# EAGLE design zumo_cam_01 (EAGLE 7.7.0)
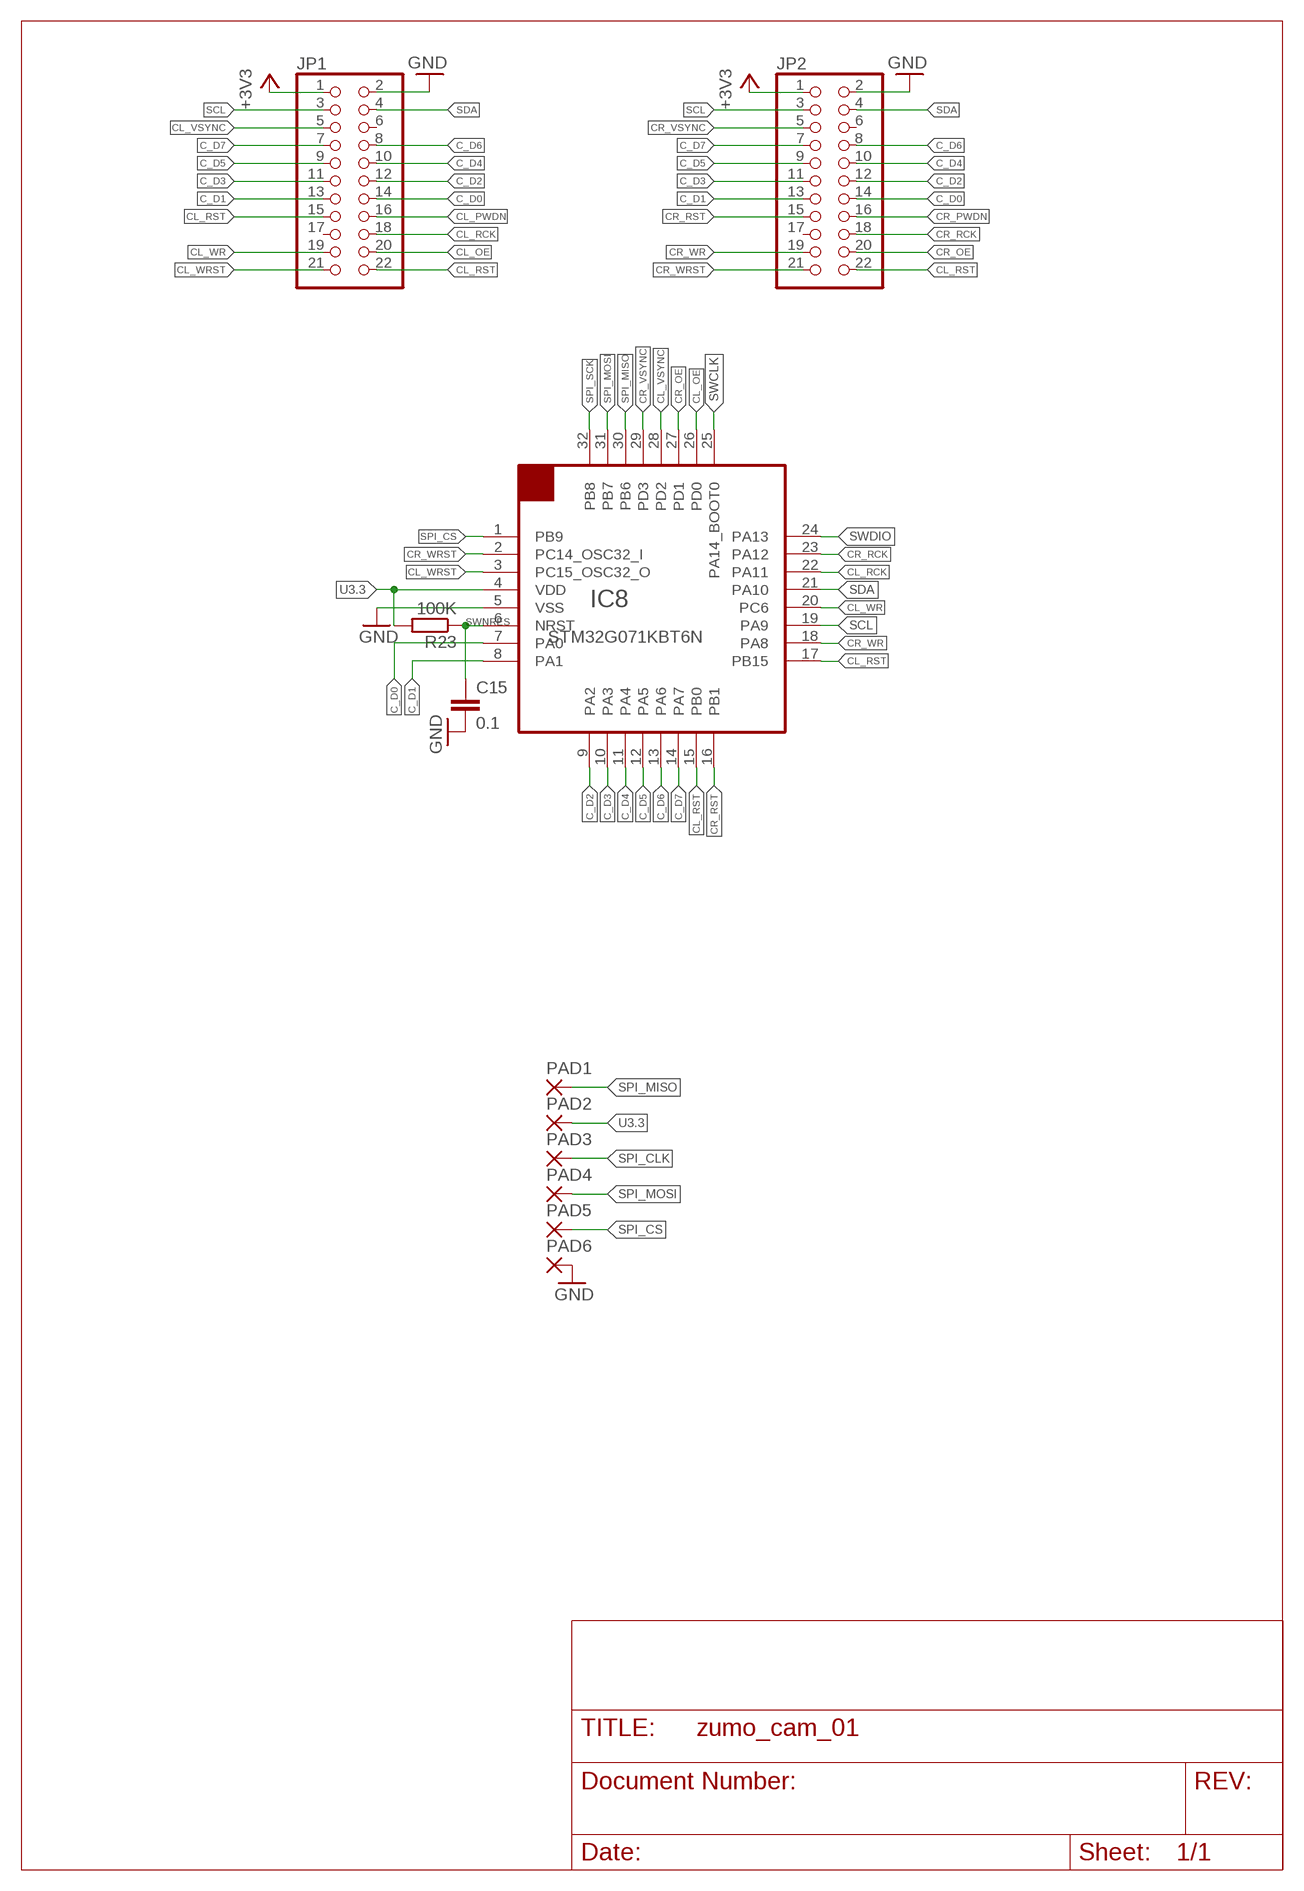
[diagram p0: schematic, sheet 1]

## Parts
C15  0.1  C-EUC0805  [C0805]
IC8  STM32G071KBT6N  [LQFP-32]
JP1  PINHD-2X11_2.54-SMD  [2X11SMD]
JP2  PINHD-2X11_2.54-SMD  [2X11SMD]
PAD1  SMD2  [SMD1,27-2,54]
PAD2  SMD2  [SMD1,27-2,54]
PAD3  SMD2  [SMD1,27-2,54]
PAD4  SMD2  [SMD1,27-2,54]
PAD5  SMD2  [SMD1,27-2,54]
PAD6  SMD2  [SMD1,27-2,54]
R23  100K  R-EU_R0805  [R0805]

## Nets
+3V3: JP1.1 JP2.1
C_D0: IC8.7(PA0) JP1.14 JP2.14
C_D1: IC8.8(PA1) JP1.13 JP2.13
C_D2: IC8.9(PA2) JP1.12 JP2.12
C_D3: IC8.10(PA3) JP1.11 JP2.11
C_D4: IC8.11(PA4) JP1.10 JP2.10
C_D5: IC8.12(PA5) JP1.9 JP2.9
C_D6: IC8.13(PA6) JP1.8 JP2.8
C_D7: IC8.14(PA7) JP1.7 JP2.7
CL_OE: IC8.26(PD0) JP1.20
CL_PWDN: JP1.16
CL_RCK: IC8.22(PA11) JP1.18
CL_RST: IC8.15(PB0) IC8.17(PB15) JP1.15 JP1.22 JP2.22
CL_VSYNC: IC8.28(PD2) JP1.5
CL_WR: IC8.20(PC6) JP1.19
CL_WRST: IC8.3(PC15_OSC32_O) JP1.21
CR_OE: IC8.27(PD1) JP2.20
CR_PWDN: JP2.16
CR_RCK: IC8.23(PA12) JP2.18
CR_RST: IC8.16(PB1) JP2.15
CR_VSYNC: IC8.29(PD3) JP2.5
CR_WR: IC8.18(PA8) JP2.19
CR_WRST: IC8.2(PC14_OSC32_I) JP2.21
GND [gnd]: C15.2 IC8.5(VSS) JP1.2 JP2.2 PAD6.1(P)
SCL: IC8.19(PA9) JP1.3 JP2.3
SDA: IC8.21(PA10) JP1.4 JP2.4
SPI_CLK: PAD3.1(P)
SPI_CS: IC8.1(PB9) PAD5.1(P)
SPI_MISO: IC8.30(PB6) PAD1.1(P)
SPI_MOSI: IC8.31(PB7) PAD4.1(P)
SPI_SCK: IC8.32(PB8)
SWCLK: IC8.25(PA14_BOOT0)
SWDIO: IC8.24(PA13)
SWNRES: C15.1 IC8.6(NRST) R23.1
U3.3 [power]: IC8.4(VDD) PAD2.1(P) R23.2
Unconnected: JP1.6 JP1.17 JP2.6 JP2.17

## Library data of the parts
C15 = rcl:C-EU: CAPACITOR, European symbol
IC8 = stm32:STM32G071KBT6N
JP1 JP2 = pinhead-1:PINHD-2X11: PIN HEADER
PAD1-PAD6 = wirepad:SMD2: SMD PAD
R23 = rcl:R-EU_: RESISTOR, European symbol

## Net classes
1 gnd: width 0.381 mm, drill 0.381 mm
2 power: width 0.381 mm, drill 0.381 mm

## Board
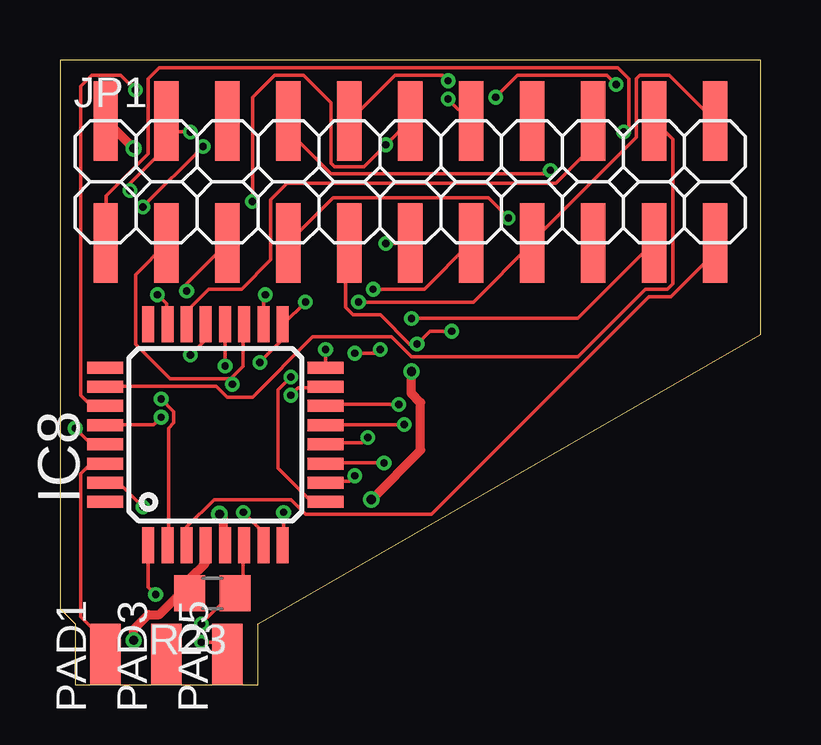
[diagram p1: board, top side]
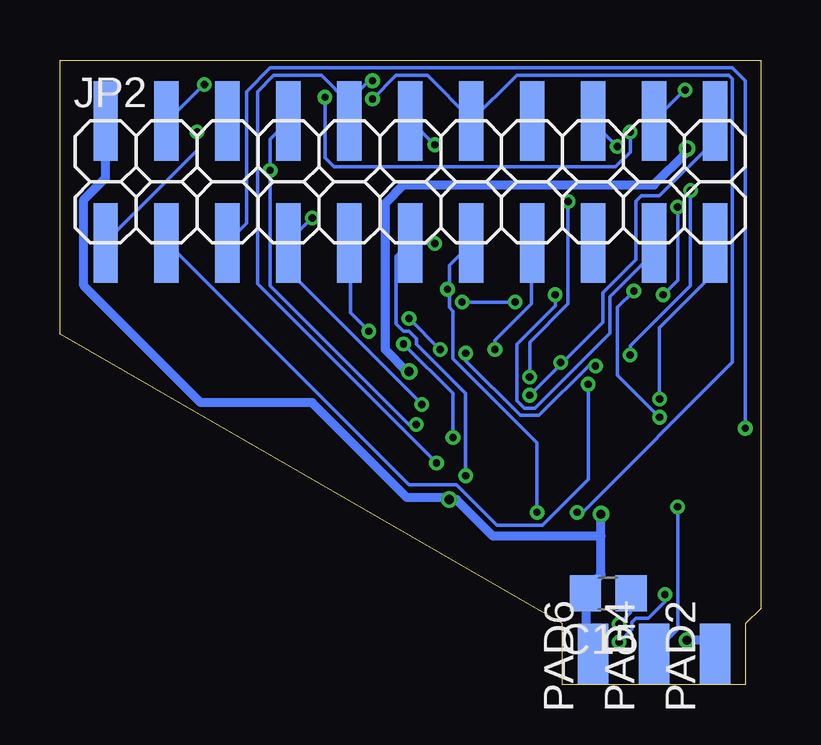
[diagram p2: board, bottom side, seen from below]

Size 29.21 x 26.04 mm. Coordinates in mm from the lower left corner, seen from the top.
Outline: 0.64,0 8.26,0 8.26,2.54 29.21,14.61 29.21,26.04 0,26.04 0,3.17 0.64,2.54 0.64,0
Copper layers (1*16): Top 0.035mm / dielectric 1.5mm / Bottom 0.035mm
Design rules "dirt_cheap_dirty_boards.v1.1": minimum track width 6mil, minimum drill 12mil, track to track 6mil, track to pad 6mil, pad to pad 6mil, via to via 6mil, smd to smd 0mil, copper to edge 10mil, drill to drill 10mil, minimum pad ring 10mil, minimum via ring 6mil, stop-mask expansion 2mil, vias tented up to drill 25mil, thermal gap 10mil

### Footprints (pad centres in the part's own frame; a part is rotated, then mirrored left to right if it is on the bottom)
C0805 = smd 1.3 x 1.5: 1 -0.95,0; 2 0.95,0
LQFP-32 = smd 1.5 x 0.5: 1 -1.8,0; 2 -1.8,-0.8; 3 -1.8,-1.6; 4 -1.8,-2.4; 5 -1.8,-3.2; 6 -1.8,-4; 7 -1.8,-4.8; 8 -1.8,-5.6; 17 7.4,-5.6; 18 7.4,-4.8; 19 7.4,-4; 20 7.4,-3.2; 21 7.4,-2.4; 22 7.4,-1.6; 23 7.4,-0.8; 24 7.4,0 | smd 0.5 x 1.5: 9 0,-7.4; 10 0.8,-7.4; 11 1.6,-7.4; 12 2.4,-7.4; 13 3.2,-7.4; 14 4,-7.4; 15 4.8,-7.4; 16 5.6,-7.4; 25 5.6,1.8; 26 4.8,1.8; 27 4,1.8; 28 3.2,1.8; 29 2.4,1.8; 30 1.6,1.8; 31 0.8,1.8; 32 0,1.8
2X11SMD = smd 1.016 x 3.302: 1 -1.27,-3.81; 2 -1.27,1.27; 3 1.27,-3.81; 4 1.27,1.27; 5 3.81,-3.81; 6 3.81,1.27; 7 6.35,-3.81; 8 6.35,1.27; 9 8.89,-3.81; 10 8.89,1.27; 11 11.43,-3.81; 12 11.43,1.27; 13 13.97,-3.81; 14 13.97,1.27; 15 16.51,-3.81; 16 16.51,1.27; 17 19.05,-3.81; 18 19.05,1.27; 19 21.59,-3.81; 20 21.59,1.27; 21 24.13,-3.81; 22 24.13,1.27
SMD1,27-2,54 = smd 1.27 x 2.54: 1 0,0
R0805 = smd 1.3 x 1.5: 1 -0.95,0; 2 0.95,0

### Placement (x,y rotation side)
C15  6.35,3.81 180 bottom
IC8  3.68,7.62 90 top
JP1  3.17,22.23 0 top
JP2  26.04,22.23 0 bottom
PAD1  1.91,1.27 0 top
PAD2  1.91,1.27 0 bottom
PAD3  4.45,1.27 0 top
PAD4  4.45,1.27 0 bottom
PAD5  6.98,1.27 0 top
PAD6  6.98,1.27 0 bottom
R23  6.35,3.81 180 top

### Tracks (layer width: path | path; a pad name or v marks a point on that pad's centre or on a via)
+3V3  (via drill 0.3)
  Top 0.152: v23.5,23.04 23.72,23.27 23.72,25.25 23.27,25.71 4.14,25.71 3.68,25.25 3.68,22.12 1.93,20.37 1.93,18.47 JP1.1
  Bottom 0.152: v23.5,23.04 23.5,22.28 27.31,18.47 JP2.1
C_D0  (via drill 0.3)
  Top 0.152: v7.64,7.19 8.41,6.43 8.41,5.89 IC8.7 | v16.18,24.41 17.09,23.5 JP1.14
  Bottom 0.152: v7.64,7.19 7.42,7.19 1.17,13.44 1.17,25.25 1.32,25.4 10.16,25.4 JP2.14 12.06,23.57 13.89,25.4 15.19,25.4 v16.18,24.41
C_D1  (via drill 0.3)
  Top 0.152: v9.32,7.19 9.32,5.89 IC8.8 | v13.06,16.48 15.19,16.48 17.09,18.39 JP1.13
  Bottom 0.152: v9.32,7.19 9.32,10.08 12.83,13.59 12.83,15.57 12.98,15.72 12.98,16.48 | 12.98,16.48 12.98,17.48 12.06,18.39 JP2.13 | 12.98,16.48 v13.06,16.48
C_D2  (via drill 0.3)
  Top 0.152: v9.63,12.83 9.09,12.29 9.09,9.02 10.46,7.64 11.07,7.64 IC8.9 | v8.03,20.14 8.03,24.49 8.94,25.4 10.16,25.4 11.3,24.26 11.3,21.74 11.46,21.59 12.67,21.59 v13.59,22.5 14.58,23.5 JP2.12
  Bottom 0.152: v9.63,12.83 9.63,14.28 8.03,15.88 v8.03,20.14 | v13.59,22.5 14.58,23.5 JP2.12
C_D3  (via drill 0.3)
  Top 0.152: v12.29,8.71 12.06,8.48 11.15,8.48 IC8.10 | v13.59,18.39 14.58,18.39 JP2.11
  Bottom 0.152: v12.29,8.71 12.29,12.14 14.35,14.2 14.35,14.43 14.66,14.73 14.88,14.73 15.19,15.04 15.19,17.86 14.66,18.39 JP2.11 14.58,18.39 v13.59,18.39
C_D4  (via drill 0.3)
  Top 0.152: v13.51,9.25 11.15,9.25 IC8.11 | JP1.10 13.97,25.4 15.95,25.4 v16.18,25.17
  Bottom 0.152: v13.51,9.25 20.98,16.71 20.98,24.71 20.3,25.4 18.31,25.4 17.17,24.26 17.17,23.5 JP2.10 17.17,24.33 16.33,25.17 v16.18,25.17
C_D5  (via drill 0.3)
  Top 0.152: v12.83,10.31 12.6,10.08 11.15,10.08 IC8.12 | JP1.9 12.06,18.39 11.91,18.24 11.91,15.72 12.22,15.42 13.36,15.42 14.58,14.2 v14.88,14.2 15.42,14.73 v16.33,14.73
  Bottom 0.152: v12.83,10.31 12.83,12.14 v14.88,14.2 | v16.33,14.73 17.09,15.49 17.09,18.39 JP2.9
C_D6  (via drill 0.3)
  Top 0.152: v14.35,10.85 11.15,10.85 IC8.13 | v20.45,21.44 20.3,21.29 11.3,21.29 9.55,23.04 9.55,23.5 JP1.8
  Bottom 0.152: v14.35,10.85 14.66,10.85 20.45,16.64 v20.45,21.44 20.45,22.73 JP2.8
C_D7  (via drill 0.3)
  Top 0.152: v14.12,11.68 11.15,11.68 IC8.14 | v18.69,19.46 17.86,20.3 11.38,20.3 9.55,18.47 JP1.7
  Bottom 0.152: v14.12,11.68 19.69,17.25 JP2.7 19.69,18.47 v18.69,19.46
CL_OE
  Top 0.152: IC8.26 1.93,12.45 6.5,12.45 6.96,11.99 8.03,11.99 10.54,14.5 13.82,14.5 14.66,13.66 21.59,13.66 24.41,16.48 25.32,16.48 25.55,16.71 25.55,22.73 24.79,23.5 JP1.20
CL_RCK
  Top 0.152: IC8.22 5.28,15.04 5.28,15.57 6.2,16.48 7.57,16.48 8.79,17.7 8.79,20.22 9.47,20.9 20.68,20.9 22.2,22.43 22.2,23.5 JP1.18
CL_RST  (via drill 0.3)
  Top 0.152: JP1.22 25.4,25.4 24.18,25.4 24.03,25.25 24.03,22.81 19.69,18.47 JP1.15 19.69,18.39 17.25,15.95 v12.45,15.95 | v9.63,12.06 9.93,12.37 11.07,12.37 IC8.15 | v8.33,13.44 9.25,14.35 9.25,14.96 IC8.17 9.32,15.04 v10.24,15.95
  Bottom 0.152: 8.29,13.4 6.58,15.11 6.58,16.33 5.21,17.7 5.21,20.14 4.98,20.37 4.22,20.37 1.93,22.66 1.93,23.5 JP2.22 | 8.29,13.4 v9.63,12.06 | v8.33,13.44 8.29,13.4 | v10.24,15.95 v12.45,15.95
CL_VSYNC  (via drill 0.3)
  Top 0.152: v4.22,11.15 3.91,10.85 1.93,10.85 IC8.28 | v5.28,16.41 5.28,16.71 JP1.5
  Bottom 0.152: v4.22,11.15 5.97,12.9 5.97,15.72 v5.28,16.41
CL_WR  (via drill 0.3)
  Top 0.152: v6.88,13.28 6.88,14.96 IC8.20 | v12.29,13.82 13.21,13.82 v13.36,13.97 | v14.66,15.27 21.59,15.27 24.71,18.39 JP1.19
  Bottom 0.152: v6.88,13.28 7.19,13.28 9.25,11.23 10.01,11.23 12.29,13.51 v12.29,13.82 | v14.66,15.27 v13.36,13.97
CL_WRST
  Top 0.152: JP1.21 27.31,18.01 25.48,16.18 24.56,16.18 15.49,7.11 10.24,7.11 9.63,7.72 6.43,7.72 5.28,6.58 5.28,5.89 IC8.3
CR_OE  (via drill 0.3)
  Top 0.152: v3.15,24.79 2.54,25.4 1.32,25.4 0.86,24.94 0.86,12.06 1.25,11.68 1.85,11.68 IC8.27
  Bottom 0.152: JP2.20 v3.15,24.79
CR_RCK  (via drill 0.3)
  Top 0.152: v4.06,16.26 4.45,15.88 4.45,15.04 IC8.23 | v5.97,22.43 v3.45,19.91
  Bottom 0.152: v4.06,16.26 3.45,16.87 v3.45,19.91 | v5.97,22.43 7.04,23.5 JP2.18
CR_RST  (via drill 0.3)
  Top 0.152: v11.07,13.97 11.07,13.28 IC8.16
  Bottom 0.152: v11.07,13.97 11.07,14.35 9.55,15.88 9.55,18.39 JP2.15
CR_VSYNC  (via drill 0.3)
  Top 0.152: v0.64,10.69 1.25,10.08 1.85,10.08 IC8.29
  Bottom 0.152: v0.64,10.69 0.64,25.17 1.17,25.71 20.45,25.71 21.44,24.71 21.44,19.23 22.2,18.47 JP2.5
CR_WR  (via drill 0.3)
  Top 0.152: v8.56,16.26 8.48,16.18 8.48,15.04 IC8.18
  Bottom 0.152: v8.56,16.26 8.56,15.8 10.16,14.2 10.16,11.84 9.86,11.53 9.4,11.53 6.27,14.66 6.27,16.18 4.45,18.01 JP2.19
CR_WRST  (via drill 0.3)
  Top 0.152: v4.22,11.91 4.75,11.38 4.75,10.92 4.52,10.69 4.52,5.89 IC8.2
  Bottom 0.152: v4.22,11.91 4.22,14.88 1.93,17.17 1.93,18.39 JP2.21
GND  (via drill 0.38)
  Top 0.381: v6.65,7.11 6.81,6.96 6.81,5.89 IC8.5 | v3.07,22.35 1.93,23.5 JP1.2 | v14.66,13.06 14.66,12.14 15.04,11.76 15.04,9.78 v12.98,7.72
  Bottom 0.381: PAD6.1 7.26,1.55 7.26,3.76 C15.2 7.26,3.99 6.65,4.6 6.65,6.2 | 6.65,6.2 v6.65,7.11 | v3.07,22.35 3.07,22.2 4.45,20.83 14.88,20.83 15.65,20.07 15.65,13.97 14.73,13.06 v14.66,13.06 | 6.65,6.2 11.15,6.2 12.67,7.72 v12.98,7.72 13.13,7.8 14.73,7.8 18.69,11.76 23.34,11.76 28.22,16.64 28.22,20.22 27.31,21.13 JP2.2
SCL  (via drill 0.3)
  Top 0.152: 7.15,12.79 7.11,12.75 4.6,12.75 3.15,14.2 3.15,17.09 4.45,18.39 JP1.3 | 7.15,12.79 7.64,13.28 7.64,14.96 IC8.19 | v7.19,12.52 7.19,12.75 7.15,12.79
  Bottom 0.152: v7.19,12.52 7.19,8.56 9.09,6.65 11,6.65 12.67,8.33 14.66,8.33 24.71,18.39 JP2.3
SDA  (via drill 0.3)
  Top 0.152: v5.44,13.74 6.04,14.35 6.04,14.96 IC8.21 | v2.92,20.6 2.92,20.9 4.45,22.43 4.45,23.04 | v23.19,25.02 22.81,25.4 19.08,25.4 v18.16,24.49 | 4.45,23.04 v5.44,23.04 | 4.45,23.04 JP1.4
  Bottom 0.152: v5.44,13.74 5.44,14.12 2.92,16.64 v2.92,20.6 | v23.19,25.02 24.71,23.5 JP2.4 | v18.16,24.49 18.16,21.97 17.78,21.59 6.04,21.59 5.44,22.2 v5.44,23.04
SPI_CS  (via drill 0.3)
  Top 0.152: IC8.1 3.68,4.06 v3.99,3.76 | v5.89,1.78 6.5,1.78 6.96,1.32 PAD5.1
  Bottom 0.152: v3.99,3.76 3.99,3.45 4.67,2.77 5.21,2.77 5.36,2.62 5.36,2.31 v5.89,1.78
SPI_MISO
  Top 0.152: IC8.30 1.85,9.17 1.25,9.17 0.86,8.79 0.86,2.84 1.85,1.85 1.85,1.32 PAD1.1
SPI_MOSI  (via drill 0.3)
  Top 0.152: v3.45,7.42 2.46,8.41 1.93,8.41 IC8.31
  Bottom 0.152: v3.45,7.42 3.45,2.31 4.45,1.32 PAD4.1
SWNRES  (via drill 0.3)
  Top 0.152: v5.89,2.54 7.11,3.76 7.26,3.76 R23.1 7.34,3.83 7.64,4.14 7.64,5.82 IC8.6
  Bottom 0.152: v5.89,2.54 5.44,3 5.44,3.76 C15.1
U3.3  (via drill 0.38)
  Top 0.381: IC8.4 6.04,5.82 6.04,5.05 5.44,4.45 5.44,3.83 R23.2 5.21,3.76 4.98,3.76 4.14,2.92 3.68,2.92 3.07,2.31 v3.07,1.85
  Bottom 0.381: v3.07,1.85 2.46,1.85 1.93,1.32 PAD2.1